# EAGLE design pcb_4 (EAGLE 8.0.2)
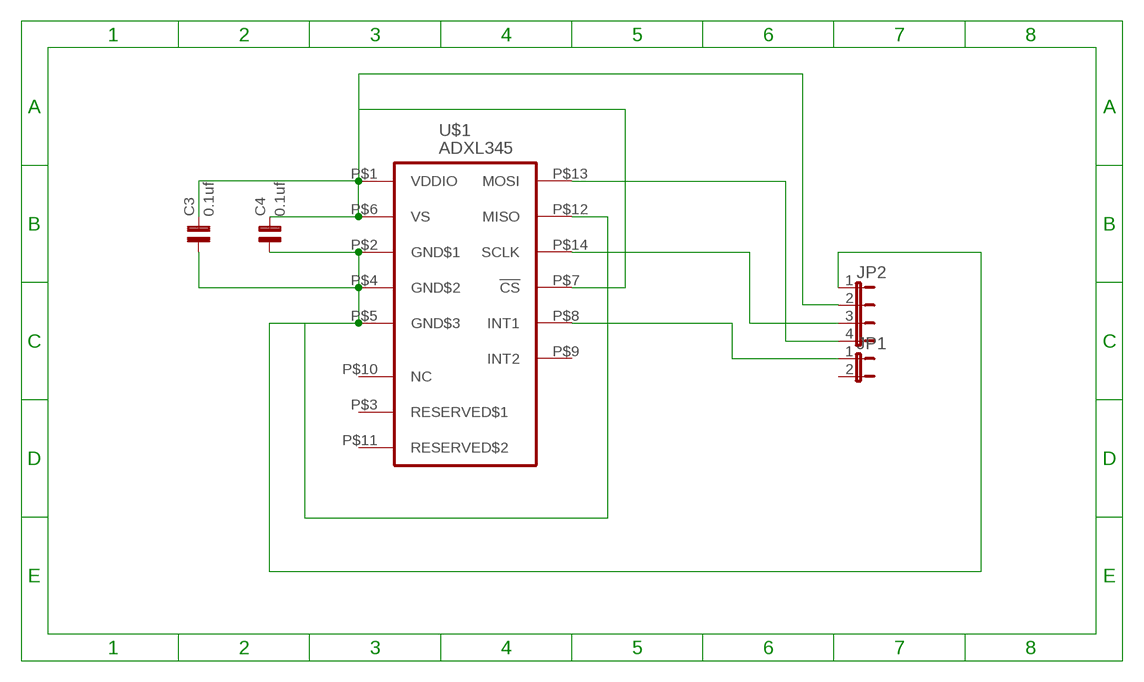
[diagram p0: schematic, sheet 1]

## Parts
C3  0.1uf  C0805  [0805]
C4  0.1uf  C0805  [0805]
JP1  JP1E  [JP1]
JP2  JP4E  [JP4]
U$1  ADXL345  [LGA14]

## Nets
N$1: C3.1 C4.1 JP2.1 U$1.P$2(GND$1) U$1.P$4(GND$2) U$1.P$5(GND$3) U$1.P$12(MISO)
N$2: C3.2 C4.2 JP2.2 U$1.P$1(VDDIO) U$1.P$6(VS) U$1.P$7(!CS)
N$3: JP2.4 U$1.P$13(MOSI)
N$4: JP2.3 U$1.P$14(SCLK)
N$5: JP1.1 U$1.P$8(INT1)
Unconnected: JP1.2 U$1.P$3(RESERVED$1) U$1.P$9(INT2) U$1.P$10(NC) U$1.P$11(RESERVED$2)

## Library data of the parts
C3 C4 = capsmd:C0805
JP1 = jumper:JP1E: JUMPER
JP2 = jumper:JP4E: JUMPER
U$1 = adxl345:ADXL345: 3-Axis, ±2 g/±4 g/±8 g/±16 g Digital Accelerometer

## Board
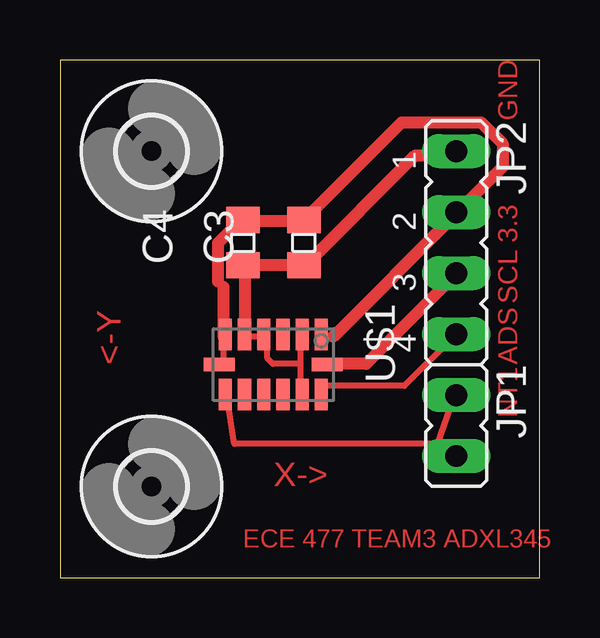
[diagram p1: board, top side]

Size 19.99 x 21.58 mm. Coordinates in mm from the lower left corner, seen from the top.
Outline: 0,0 19.99,0 19.99,21.58 0,21.58 0,0
Copper layers (1*16): Top 0.035mm / dielectric 1.5mm / Bottom 0.035mm
Design rules "default": minimum track width 10mil, minimum drill 24mil, track to track 8mil, track to pad 8mil, pad to pad 8mil, via to via 8mil, smd to smd 8mil, copper to edge 40mil, drill to drill 8mil, minimum pad ring 10mil, minimum via ring 8mil, stop-mask expansion 4mil, vias tented up to drill 0mil, thermal gap 10mil

### Footprints (pad centres in the part's own frame; a part is rotated, then mirrored left to right if it is on the bottom)
0805 = smd 1.092 x 1.397: 1 -0.94,0; 2 0.94,0
JP1 = drill 0.914 long: 1 0,-1.27; 2 0,1.27
JP4 = drill 0.914 long: 1 -3.81,0; 2 -1.27,0; 3 1.27,0; 4 3.81,0
LGA14 = smd 1.3 x 0.55: P$1 -1.25,2; P$2 -1.25,1.2; P$3 -1.25,0.4; P$4 -1.25,-0.4; P$5 -1.25,-1.2; P$6 -1.25,-2; P$8 1.25,-2; P$9 1.25,-1.2; P$10 1.25,-0.4; P$11 1.25,0.4; P$12 1.25,1.2; P$13 1.25,2 | smd 0.55 x 1.3: P$7 0,-2.25; P$14 0,2.25
2,8 = hole 2.8: 0,0

### Placement (x,y rotation side)
C3  10.16,13.97 90 top
C4  7.62,13.97 90 top
JP1  16.51,6.35 180 top
JP2  16.51,13.97 270 top
U$1  8.89,8.89 270 top
U$2  [2,8]  3.81,3.81 0 top
U$3  [2,8]  3.81,17.78 0 top

### Tracks (layer width: path | path; a pad name or v marks a point on that pad's centre or on a via)
N$1
  Top 0.254: 10.01,8.91 10.01,9.83 U$1.P$2 | 10.01,8.91 10.01,8 U$1.P$12 | 10.01,8.91 8.87,8.91 8.64,9.14 8.64,9.83 U$1.P$4 8.41,10.06 7.72,10.06 U$1.P$5 | 7.72,13.03 C4.1 | 16.41,17.6 JP2.1 | 10.24,13.03 C3.1
  Top 0.508: C3.1 7.72,13.03 7.72,10.06 | 16.41,17.6 14.81,17.6 10.24,13.03
N$2
  Top 0.254: U$1.P$7 6.81,8.91 6.81,9.83 U$1.P$6 6.81,10.06 | 7.72,14.86 C4.2 7.49,14.86 | 10.01,14.86 C3.2 10.24,15.09 10.34,15.09 | 6.58,12.34 6.81,12.12 | 11.38,10.06 10.92,10.06 U$1.P$1 | 16.41,15.09 JP2.2 16.64,15.32
  Top 0.508: 10.01,14.86 7.72,14.86 | 6.81,12.12 6.81,10.06 | 6.58,12.34 6.58,13.95 7.49,14.86 | 16.41,15.09 11.38,10.06 | 10.34,15.09 14.22,18.97 17.55,18.97 18.47,18.06 18.47,17.14 16.64,15.32
N$3
  Top 0.254: JP2.4 14.35,8 10.92,8 U$1.P$13
N$4
  Top 0.254: 11.15,8.91 U$1.P$14 | 16.41,12.57 JP2.3
  Top 0.508: 11.15,8.91 12.75,8.91 16.41,12.57
N$5
  Top 0.254: U$1.P$8 7.04,7.77 7.04,7.09 7.26,5.59 15.72,5.59 16.41,7.54 JP1.1

### Text on the board
Top: GND | 3.3 | SCL | <-Y | ADS | INT1 | X-> | ECE 477 TEAM3 ADXL345